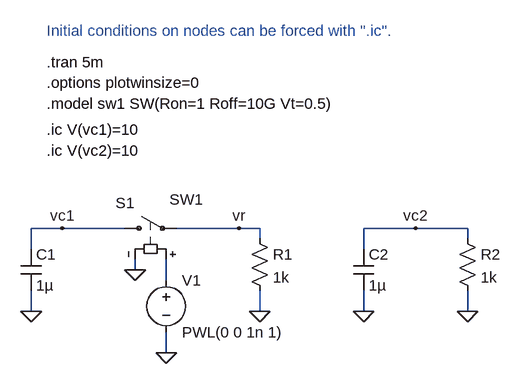
[diagram p0: schematic initial_ic.asc]
initial_ic.asc, the LTspice schematic file:
Version 4
SHEET 1 1052 680
WIRE 112 144 64 144
WIRE 208 144 112 144
WIRE 384 144 288 144
WIRE 416 144 384 144
WIRE 656 144 576 144
WIRE 736 144 656 144
WIRE 416 160 416 144
WIRE 736 160 736 144
WIRE 64 176 64 144
WIRE 576 176 576 144
WIRE 224 208 224 192
WIRE 272 224 272 192
WIRE 64 272 64 240
WIRE 416 272 416 240
WIRE 576 272 576 240
WIRE 736 272 736 240
WIRE 272 336 272 304
FLAG 224 208 0
FLAG 64 272 0
FLAG 272 336 0
FLAG 416 272 0
FLAG 112 144 vc1
FLAG 384 144 vr
FLAG 576 272 0
FLAG 736 272 0
FLAG 656 144 vc2
SYMBOL voltage 272 208 R0
WINDOW 123 0 0 Left 0
WINDOW 39 0 0 Left 0
SYMATTR InstName V1
SYMATTR Value PWL(0 0 1n 1)
SYMBOL sw 192 144 R270
WINDOW 0 39 2 VRight 0
WINDOW 3 44 85 VRight 0
SYMATTR InstName S1
SYMATTR Value SW1
SYMBOL cap 48 176 R0
SYMATTR InstName C1
SYMATTR Value 1µ
SYMBOL res 400 144 R0
SYMATTR InstName R1
SYMATTR Value 1k
SYMBOL cap 560 176 R0
SYMATTR InstName C2
SYMATTR Value 1µ
SYMBOL res 720 144 R0
SYMATTR InstName R2
SYMATTR Value 1k
TEXT 88 -112 Left 0 !.tran 5m
TEXT 88 -80 Left 0 !.options plotwinsize=0
TEXT 88 -48 Left 0 !.model sw1 SW(Ron=1 Roff=10G Vt=0.5)
TEXT 88 -8 Left 0 !.ic V(vc1)=10
TEXT 88 24 Left 0 !.ic V(vc2)=10
TEXT 88 -160 Left 0 ;Initial conditions on nodes can be forced with ".ic".

The netlist it stands for:
* initial_ic.asc
V1 N001 0 PWL(0 0 1n 1)
S1 vc1 vr N001 0 SW1
C1 vc1 0 1µ
R1 vr 0 1k
C2 vc2 0 1µ
R2 vc2 0 1k
.tran 5m
.options plotwinsize=0
.model sw1 SW(Ron=1 Roff=10G Vt=0.5)
.ic V(vc1)=10
.ic V(vc2)=10
* Initial conditions on nodes can be forced with ".ic".
.backanno
.end